# Altium schematic sheet Breakout.SchDoc
size A4; DocumentNumber: 1; SheetNumber: 1
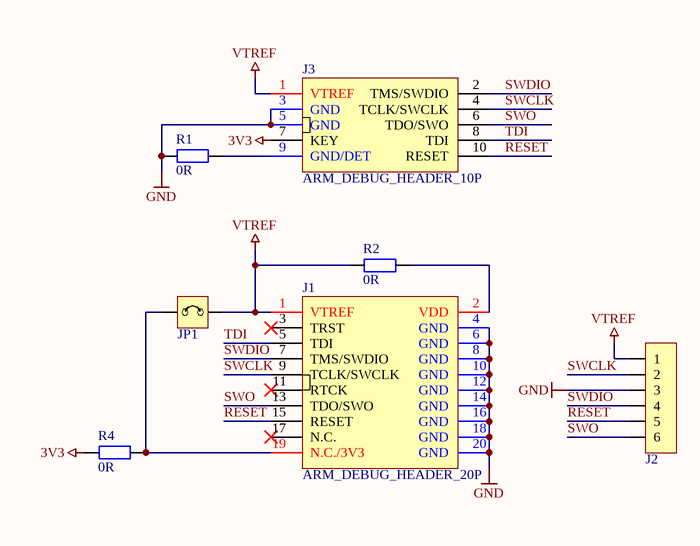
[diagram p0: Breakout.SchDoc]

## Parts
J1  ARM_DEBUG_HEADER_20P  [ARM_STD_20P_HEADER-2.54-20P2]
J2  PINHDR-6P1  [HEADER-2.54-6P1]  (value not drawn)
J3  ARM_DEBUG_HEADER_10P  [ARM_CORTEX_DEBUG_HEADER-1.27-10P-2R]
JP1  ON/OFF  [HEADER-2.54-2P1]  (value not drawn)
R1  0R  [R0603_RF_M]
R2  0R  [R0603_RF_M]
R4  0R  [R0603_RF_M]

## Nets
3V3: J3.7(KEY) R4.1
GND: J1.4(GND) J1.6(GND) J1.8(GND) J1.10(GND) J1.12(GND) J1.14(GND) J1.16(GND) J1.18(GND) J1.20(GND) J2.3 J3.3(GND) J3.5(GND) R1.1
VTREF: J1.1(VTREF) J2.1 J3.1(VTREF) JP1.2 R2.1
RESET: J1.15(RESET) J2.5 J3.10(RESET)
SWCLK: J1.9(TCLK/SWCLK) J2.2 J3.4(TCLK/SWCLK)
SWDIO: J1.7(TMS/SWDIO) J2.4 J3.2(TMS/SWDIO)
SWO: J1.13(TDO/SWO) J2.6 J3.6(TDO/SWO)
TDI: J1.5(TDI) J3.8(TDI)
NetJ1_2: J1.2(VDD) R2.2
NetJ1_19: J1.19(N.C./3V3) JP1.1 R4.2
NetJ3_9: J3.9(GND/DET) R1.2

Not connected (* = marked no-connect by the designer): J1 3(TRST)* 11(RTCK)* 17(N.C.)*

## Notes on the sheet
- Author
- Date
- Revision
- Size
- A4
- Sheet
- of

## Library data of the parts
J1 = ARM_DEBUG_HEADER_20P: ARM Standard 20-Pin Header
J2 = PINHDR-6P1: Pin Header Single Row 6 Positions; Mounting Technology: THT
J3 = ARM_DEBUG_HEADER_10P: ARM Cortex Debug 10-Pin Header
JP1 = JP-SPST: Jumper (SPST/ON-OFF)
R1 R2 R4 = R: Resistor; Manufacturer: Generic Brand; Power Rating: ? W; Max Voltage: ? V; Value: 0R; Tolerance: ?; Supplier Link: http://; Category: Resistor; Mounting Technology: SMT